# EAGLE design application (EAGLE 9.6.2)
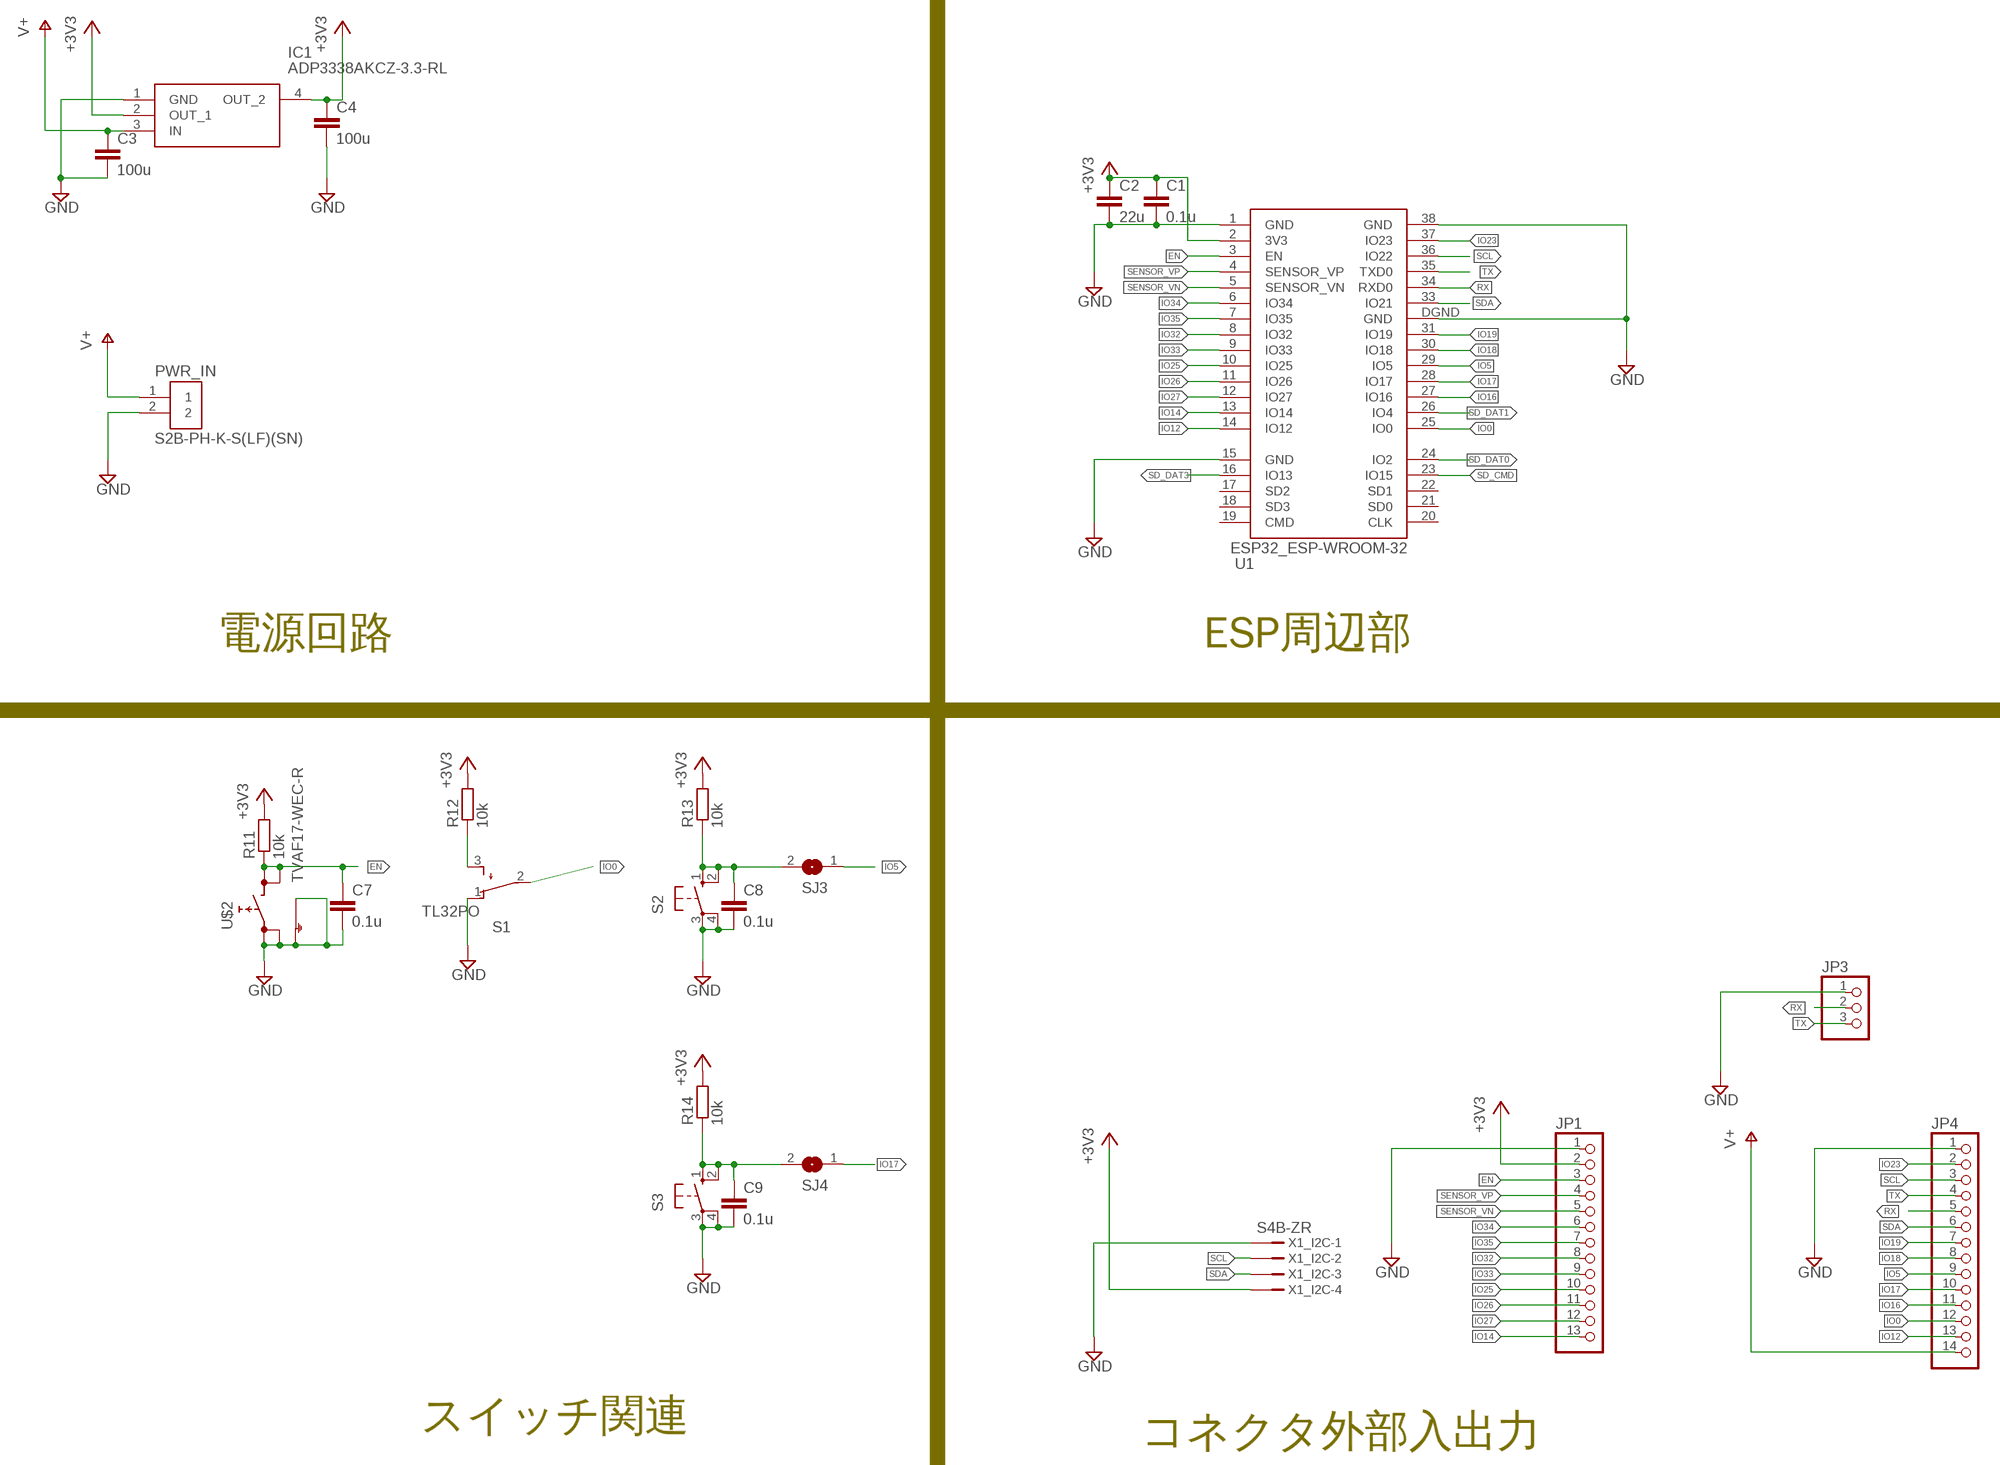
[diagram p0: schematic, sheet 1]

## Parts
C1  0.1u  C-EUC0603K  [C0603K]
C2  22u  C-EUC0805  [C0805]
C3  100u  C-EUC1206  [C1206]
C4  100u  C-EUC1206  [C1206]
C7  0.1u  C-EUC0603K  [C0603K]
C8  0.1u  C-EUC0603K  [C0603K]
C9  0.1u  C-EUC0603K  [C0603K]
IC1  ADP3338AKCZ-3.3-RL  [SOT230P700X180-4N]
JP1  PINHD-1X13  [1X13]
JP3  PINHD-1X3  [1X03]
JP4  PINHD-1X14  [1X14]
PWR_IN  S2B-PH-K-S(LF)(SN)  [S2B-PH-K-S(LF)(SN)]
R11  10k  R-EU_R0603  [R0603]
R12  10k  R-EU_R0603  [R0603]
R13  10k  R-EU_R0603  [R0603]
R14  10k  R-EU_R0603  [R0603]
S1  TL32PO  [TL3XPO]
S2  10-XX  [B3F-10XX]
S3  10-XX  [B3F-10XX]
SJ3  SJW  [SJW]
SJ4  SJW  [SJW]
U1  ESP32_ESP-WROOM-32  [ESP32_ESP-WROOM-32]
U$2  TVAF17-WEC-R  [TVAF17-WEC-R]
X1_I2C  S4B-ZR  [S4B-ZR]

## Nets
+3V3: C1.1 C2.1 C4.1 IC1.2(OUT_1) IC1.4(OUT_2) JP1.2 R11.2 R12.2 R13.2 R14.2 U1.2(3V3) X1_I2C.4
EN: C7.1 JP1.3 R11.1 U1.3(EN) U$2.P$3 U$2.P$4
GND: C1.2 C2.2 C3.2 C4.2 C7.2 C8.2 C9.2 IC1.1(GND) JP1.1 JP3.1 JP4.1 PWR_IN.2 S1.1(O) S2.3(P) S2.4(P1) S3.3(P) S3.4(P1) U1.1(GND) U1.15(GND) U1.38(GND) U1.DGND(GND) U$2.P$1 U$2.P$2 U$2.P$5 U$2.P$6 X1_I2C.1
IO0: JP4.12 S1.2(P) U1.25(IO0)
IO5: JP4.9 SJ3.1 U1.29(IO5)
IO12: JP4.13 U1.14(IO12)
IO14: JP1.13 U1.13(IO14)
IO16: JP4.11 U1.27(IO16)
IO17: JP4.10 SJ4.1 U1.28(IO17)
IO18: JP4.8 U1.30(IO18)
IO19: JP4.7 U1.31(IO19)
IO23: JP4.2 U1.37(IO23)
IO25: JP1.10 U1.10(IO25)
IO26: JP1.11 U1.11(IO26)
IO27: JP1.12 U1.12(IO27)
IO32: JP1.8 U1.8(IO32)
IO33: JP1.9 U1.9(IO33)
IO34: JP1.6 U1.6(IO34)
IO35: JP1.7 U1.7(IO35)
N$2: C8.1 R13.1 S2.1(S) S2.2(S1) SJ3.2
N$3: C9.1 R14.1 S3.1(S) S3.2(S1) SJ4.2
N$4: R12.1 S1.3(S)
RX: JP3.2 JP4.5 U1.34(RXD0)
SCL: JP4.3 U1.36(IO22) X1_I2C.2
SD_CMD: U1.23(IO15)
SD_DAT0: U1.24(IO2)
SD_DAT1: U1.26(IO4)
SD_DAT3: U1.16(IO13)
SDA: JP4.6 U1.33(IO21) X1_I2C.3
SENSOR_VN: JP1.5 U1.5(SENSOR_VN)
SENSOR_VP: JP1.4 U1.4(SENSOR_VP)
TX: JP3.3 JP4.4 U1.35(TXD0)
V+: C3.1 IC1.3(IN) JP4.14 PWR_IN.1
Unconnected: U1.17(SD2) U1.18(SD3) U1.19(CMD) U1.20(CLK) U1.21(SD0) U1.22(SD1)

## Notes on the sheet
- 電源回路 | ESP周辺部
- スイッチ関連
- コネクタ外部入出力

## Library data of the parts
C1 C7-C9 = rcl:C-EU: CAPACITOR, European symbol; SPICEPREFIX: C; TYPE: C1608JB1H104K
C2 = rcl:C-EU: CAPACITOR, European symbol; SPICEPREFIX: C; TYPE: GRM21BR61E226ME44
C3 C4 = rcl:C-EU: CAPACITOR, European symbol; SPICEPREFIX: C; TYPE: GRM31C61A107ME05
IC1 = SamacSys_Parts:ADP3338AKCZ-3.3-RL: LDO Voltage Regulator anyCAP 1A SOT223-3 Analog Devices ADP3338AKCZ-3.3-RL, LDO Voltage Regulator, 1.6A, 3.3 V +/-0.8%, 2.7 8 Vin, 3 + Tab-Pin SOT-223 Source: Datasheet <http://www.analog.com/media/en/technical-documentation/data-sheets/ADP3338.pdf>; DESCRIPTION: LDO Voltage Regulator anyCAP 1A SOT223-3 Analog Devices ADP3338AKCZ-3.3-RL, LDO Voltage Regulator, 1.6A, 3.3 V +/-0.8%, 2.7 8 Vin, 3 + Tab-Pin SOT-223; HEIGHT: 1.8mm; MANUFACTURER_NAME: Analog Devices; MANUFACTURER_PART_NUMBER: ADP3338AKCZ-3.3-RL; MOUSER_PART_NUMBER: 584-ADP3338AKCZ3.3R; MOUSER_PRICE-STOCK: https://www.mouser.co.uk/ProductDetail/Analog-Devices/ADP3338AKCZ-33-RL?qs=WIvQP4zGangPtIg4n%252B1tTA%3D%3D
JP1 = pinhead:PINHD-1X13: PIN HEADER
JP3 = pinhead:PINHD-1X3: PIN HEADER
JP4 = pinhead:PINHD-1X14: PIN HEADER
PWR_IN = Connectors:S2B-PH-K-S(LF)(SN): CONN HEADER R/A 2POS 2MM Manufacturer's datasheet <http://www.jst-mfg.com/product/pdf/eng/ePH.pdf>; CREATED_BY: PCBLayout.com; DIGI_KEY_PART_NUMBER: 455-1719-ND; MANUFACTURER: JST Sales America Inc.; MPN: S2B-PH-K-S(LF)(SN)
R11-R14 = rcl:R-EU_: RESISTOR, European symbol; SPICEPREFIX: R
S1 = switch:TL32PO: TINY SWITCH ON - MOM Source: http://www2.produktinfo.conrad.com/datenblaetter/700000-724999/705152-da-01-de-Subminiaturschalter_TL_36YO.pdf
S2 S3 = switch-omron:10-XX: OMRON SWITCH; MPN: B3F-1000; OC_FARNELL: 176432; OC_NEWARK: 36M3542
SJ3 SJ4 = jumper:SJ: SMD solder JUMPER
U1 = application:ESP32_ESP-WROOM-32: Espressif Systems ESP-WROOM-32
U$2 = untitled:TVAF17-WEC-R
X1_I2C = con-jst:?4B-ZR: ZH CONNECTOR 1.5 mm, 4 pin 1 row Source: http://www.jst.com .. eZH.pdf; MF: FARNELL; MPN: S4B-ZR(LF)(SN); OC_FARNELL: 9491830; OC_NEWARK: 38K8076

## Board
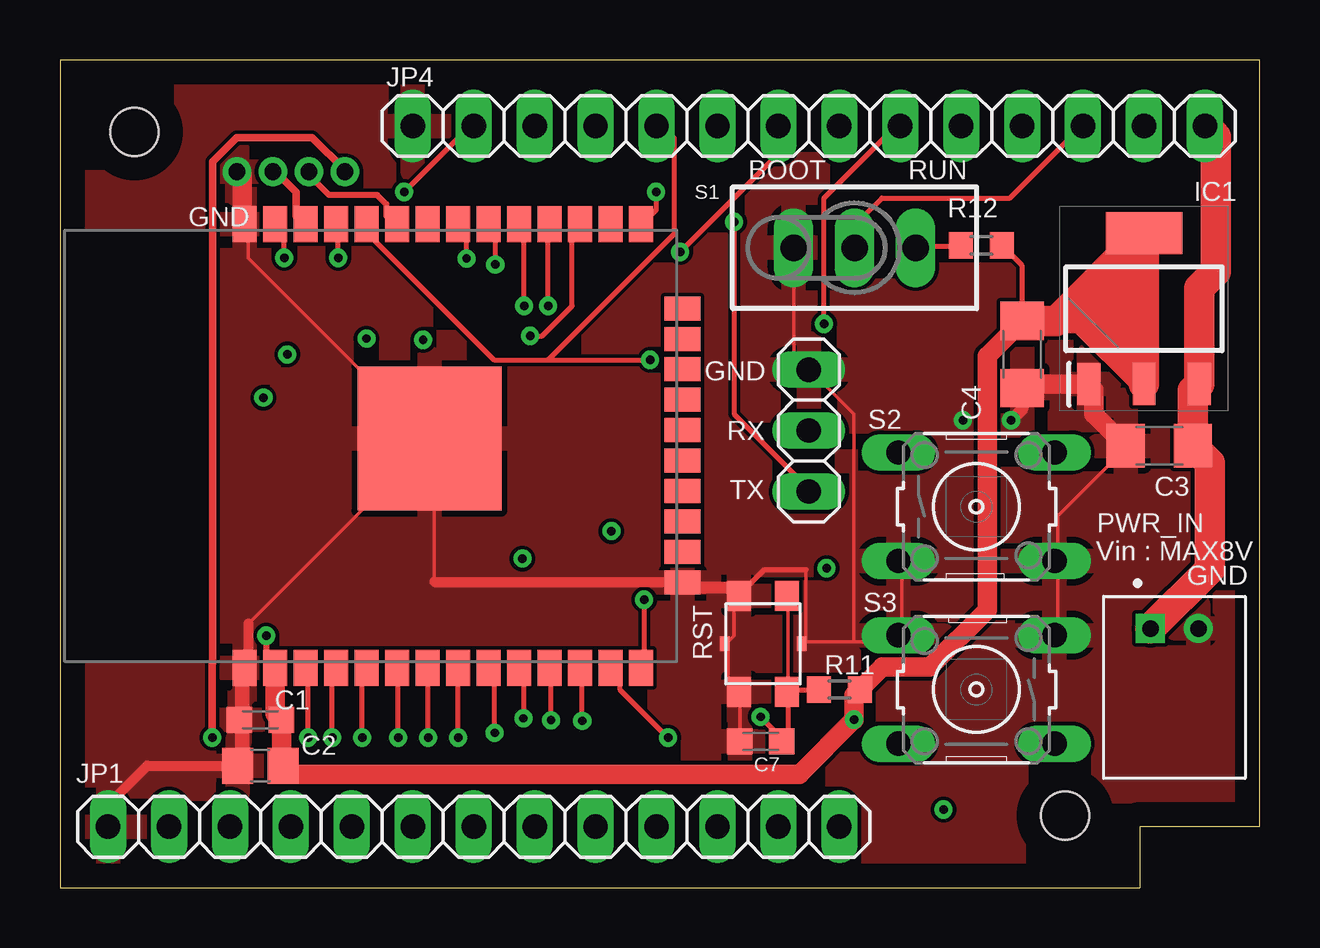
[diagram p1: board, top side]
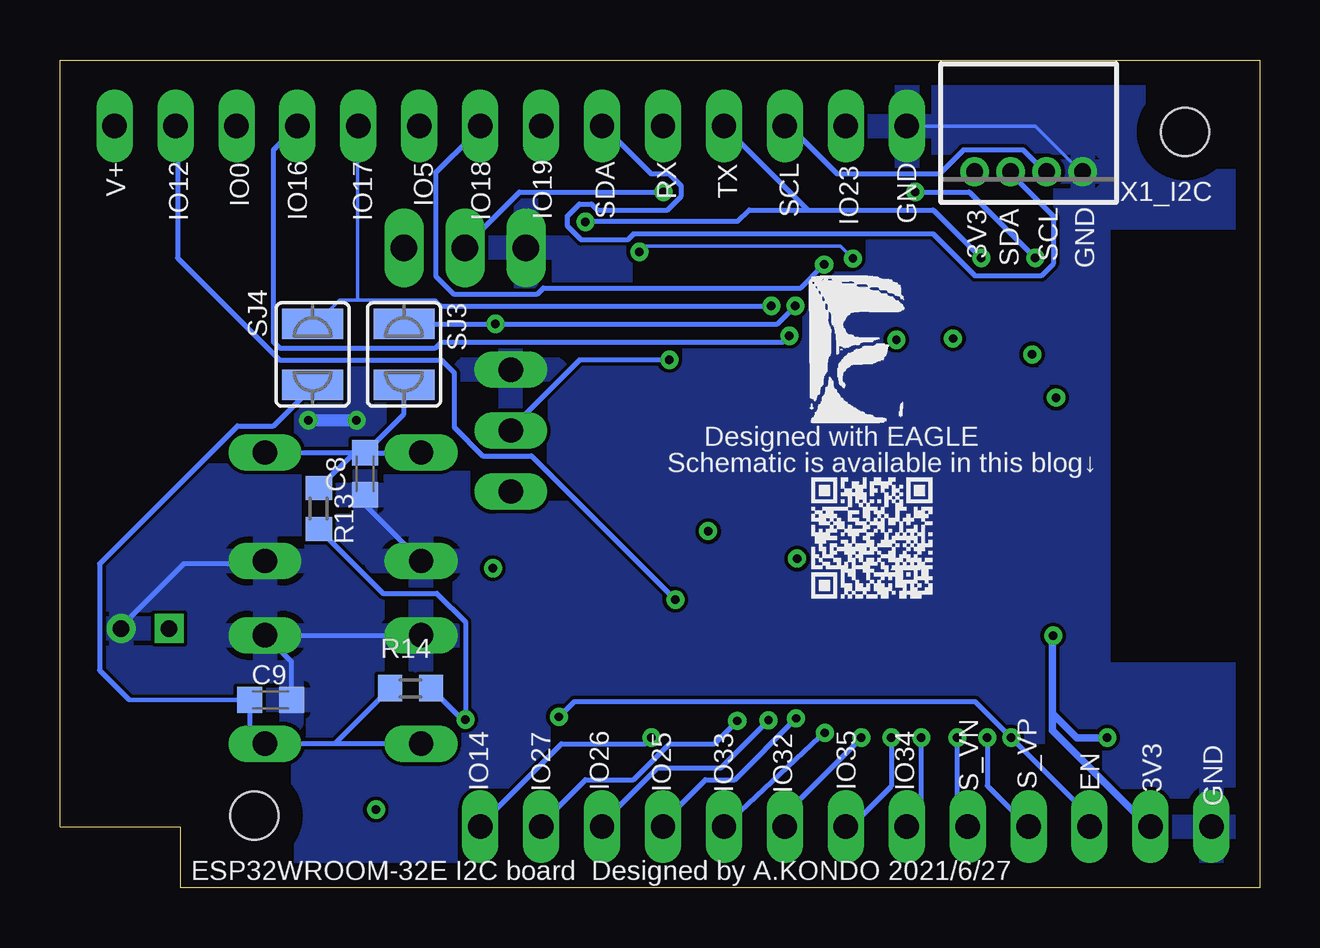
[diagram p2: board, bottom side, seen from below]

Size 50 x 34.5 mm. Coordinates in mm from the lower left corner, seen from the top.
Outline: 0,0 45,0 45,2.54 50,2.54 50,34.5 0,34.5 0,0
Copper layers (1*16): Top 0.035mm / dielectric 1.5mm / Bottom 0.035mm
Design rules "default": minimum track width 6mil, minimum drill 0.35mm, track to track 6mil, track to pad 6mil, pad to pad 6mil, via to via 6mil, smd to smd 6mil, copper to edge 40mil, drill to drill 6mil, minimum pad ring 10mil, minimum via ring 8mil, stop-mask expansion 4mil, vias tented up to drill 0mil, thermal gap 10mil
Holes 2 mm at 41.9,3 3.1,31.5

### Footprints (pad centres in the part's own frame; a part is rotated, then mirrored left to right if it is on the bottom)
C0603K = smd 1.05 x 1.08: 1 -0.875,0; 2 0.875,0
C0805 = smd 1.3 x 1.5: 1 -0.95,0; 2 0.95,0
C1206 = smd 1.6 x 1.8: 1 -1.4,0; 2 1.4,0
SOT230P700X180-4N = smd 1.75 x 0.95: 1 -3.15,2.3; 2 -3.15,0; 3 -3.15,-2.3 | smd 1.75 x 3.2: 4 3.15,0
1X13 = drill 1.016 long: 1 -15.24,0; 2 -12.7,0; 3 -10.16,0; 4 -7.62,0; 5 -5.08,0; 6 -2.54,0; 7 0,0; 8 2.54,0; 9 5.08,0; 10 7.62,0; 11 10.16,0; 12 12.7,0; 13 15.24,0
1X03 = drill 1.016 long: 1 -2.54,0; 2 0,0; 3 2.54,0
1X14 = drill 1.016 long: 1 -16.51,0; 2 -13.97,0; 3 -11.43,0; 4 -8.89,0; 5 -6.35,0; 6 -3.81,0; 7 -1.27,0; 8 1.27,0; 9 3.81,0; 10 6.35,0; 11 8.89,0; 12 11.43,0; 13 13.97,0; 14 16.51,0
S2B-PH-K-S(LF)(SN) = drill 0.7 square: 1 -1,0 | drill 0.7: 2 1,0
R0603 = smd 1 x 1.1: 1 -0.85,0; 2 0.85,0
TL3XPO = drill 1.1 pad 1.422 long: 1 -2.54,0; 2 0,0; 3 2.54,0
B3F-10XX = drill 1.016 long: 1 -3.251,2.261; 2 3.251,2.261; 3 -3.251,-2.261; 4 3.251,-2.261
SJW = smd 1.27 x 2.54: 1 -1.27,0; 2 1.27,0
ESP32_ESP-WROOM-32 = smd 1.5 x 1: 1 -9.25,7; 2 -9.25,5.73; 3 -9.25,4.46; 4 -9.25,3.19; 5 -9.25,1.92; 6 -9.25,0.65; 7 -9.25,-0.62; 8 -9.25,-1.89; 9 -9.25,-3.16; 10 -9.25,-4.43; 11 -9.25,-5.7; 12 -9.25,-6.97; 13 -9.25,-8.24; 14 -9.25,-9.51; 25 9.25,-9.51; 26 9.25,-8.24; 27 9.25,-6.97; 28 9.25,-5.7; 29 9.25,-4.43; 30 9.25,-3.16; 31 9.25,-1.89; 32 9.25,-0.62; 33 9.25,0.65; 34 9.25,1.92; 35 9.25,3.19; 36 9.25,4.46; 37 9.25,5.73; 38 9.25,7 | smd 1 x 1.5: 15 -5.7,-11.25; 16 -4.43,-11.25; 17 -3.16,-11.25; 18 -1.89,-11.25; 19 -0.62,-11.25; 20 0.65,-11.25; 21 1.92,-11.25; 22 3.19,-11.25; 23 4.46,-11.25; 24 5.73,-11.25 | smd 6 x 6: DGND 0.3,-0.7
TVAF17-WEC-R = smd 1.25 x 1: P$1 -2,1; P$2 2,1; P$3 -2,-1; P$4 2,-1 | smd 0.6 x 0.4: P$5 0,1.6; P$6 0,-1.6
S4B-ZR = drill 0.7 pad 1.1: 1 -2.25,0; 2 -0.75,0; 3 0.75,0; 4 2.25,0

### Placement (x,y rotation side)
C1  8.36,6.99 180 top
C2  8.36,5.08 180 top
C3  45.82,18.41 180 top
C4  40.11,22.23 270 top
C7  29.21,6.1 180 top
C8  37.29,17.25 270 bottom
C9  41.22,7.82 0 bottom
IC1  45.19,24.13 90 top
JP1  17.25,2.54 0 top
JP3  31.21,19.05 270 top
JP4  31.21,31.75 0 top
PWR_IN  46.45,10.79 0 top
R11  32.48,8.26 0 top
R12  38.4,26.77 0 top
R13  39.22,15.8 270 bottom
R14  35.38,8.31 0 bottom
S1  33.12,26.67 0 top
S2  38.2,15.88 0 top
S3  38.2,8.26 180 top
SJ3  35.66,22.23 270 bottom
SJ4  39.47,22.23 270 bottom
U1  14.71,18.41 90 top
U$2  29.31,10.16 90 top
X1_I2C  9.62,29.84 180 bottom

### Tracks (layer width: path | path; a pad name or v marks a point on that pad's centre or on a via)
+3V3  (via drill 0.35)
  Top 0.152: v33.1,7 | 8.6,9.5 8.85,9.25 U1.2
  Top 0.2: C4.1 40.11,25.92 R12.2
  Top 0.254: v8.6,10.5 8.6,9.5
  Top 0.305: v6.35,6.25 6.35,9.34 6.36,9.35 6.36,30.26 7.36,31.27 10.51,31.27 11.88,29.91 X1_I2C.4
  Top 0.813: U1.2 8.97,7.24 C1.1 9.23,5.16 C2.1 9.67,4.72 30.81,4.72 v33.1,7 | v33.1,7 33.1,8.02 R11.2 34.27,9.2 36.26,9.2 38.65,11.58 38.65,22.17 C4.1 | 43.42,24.52 42.98,24.08 42.98,23.62
  Top 1.016: IC1.2 42.54,23.62 | C4.1 42.54,23.62 | 42.54,23.62 42.98,23.62 43.61,23.62 44.6,22.63 45.17,23.2 43.85,24.52 | 43.85,24.52 43.42,24.52 | 45.19,25.88 43.85,24.55 43.85,24.52
  Top 1.27: C4.1 41.53,23.62 IC1.4 45.19,25.88 IC1.2
  Bottom 0.152: 8.62,10.47 v8.6,10.5
  Bottom 0.2: 6.35,4.27 | 4.62,2.54 JP1.2 | R13.2 36.54,12.27 34.29,12.27 33.1,11.07 v33.1,7 33.23,7 R14.2
  Bottom 0.305: 8.62,10.47 8.62,7.26 | 8.62,7.26 8.62,6.54 6.35,4.27 | 6.35,4.27 4.62,2.54 | v6.35,6.25 7.61,6.25 8.62,7.26
EN  (via drill 0.35)
  Top 0.152: 30.35,6.34 30.14,6.15 C7.1 | 30.35,8 U$2.P$3 30.35,8.25 30.35,12 U$2.P$4 | 31.6,8.25 R11.1 | 10.35,9 U1.3
  Top 0.2: 30.35,8 30.35,6.34 | 30.35,8.25 31.6,8.25 | v10.35,6.25 10.35,9 | v29.2,7.12 30.14,6.18 30.14,6.15
  Bottom 0.152: 6.85,2.75 JP1.3
  Bottom 0.2: 6.85,2.75 v10.35,6.25 11.85,7.75 28.57,7.75 v29.2,7.12
GND  (via drill 0.35)
  Top 0.152: 42.85,21 IC1.1 43.1,20.75 | 40.35,21 C4.2 | 44.35,18.5 C3.2 44.35,18.25 41.6,15.5 41.6,13.75 S2.4 41.6,13.5 41.6,10.75 S3.3 | S1.1 30.6,26.5 30.6,22.25 31.1,21.75 JP3.1 31.35,21.5 33.1,19.75 33.1,10.25 | C7.2 28.35,6.12 28.35,8 U$2.P$1 28.1,8.25 27.85,8.5 27.85,10 U$2.P$5 27.85,10.25 28.1,10.5 28.1,12 U$2.P$2 | 28.1,12.5 28.1,12.25 U$2.P$2 | 26.1,12.5 U1.15 25.85,12.75 | 33.1,10.25 34.85,10.25 34.85,10.5 S3.4 35.1,10.75 35.1,13.5 S2.3 | 33.1,10.25 31.1,10.25 | 31.1,10.25 31.1,13.25 | 28.35,12.25 U$2.P$2 | 31.1,10.25 U$2.P$6 | 7.6,6.75 C1.2 7.6,7 | 7.6,5.25 C2.2 7.35,5 | 7.6,9 U1.1 7.85,9.25 | 7.6,27.75 U1.38 7.85,27.5 7.85,26.25 15.35,18.75 U1.DGND | 7.85,11 15.4,18.55 U1.DGND | 15.6,12.75 15.6,18.5 U1.DGND
  Top 0.2: 28.35,12.25 29.35,13.25 31.1,13.25
  Top 0.406: 7.85,11 7.85,9.25 | 15.6,12.75 25.85,12.75 | JP1.1 2,3.45 3.63,5.08 7.27,5.08 7.35,5
  Top 0.508: 28.1,12.5 26.1,12.5 | C4.2 40.11,19.94 v39.65,19.48
  Top 0.61: 7.6,5.25 7.6,6.75 | 7.6,7 7.6,9
  Top 0.813: 40.35,21 42.85,21 | 44.35,18.5 43.1,19.75 43.1,20.75 | 7.6,27.75 7.6,29.75 X1_I2C.1
  Bottom 0.152: JP4.1 9.35,31.75 7.6,30 X1_I2C.1
  Bottom 0.2: PWR_IN.2 47.35,11 44.85,13.5 41.6,13.5 S2.4 | C8.2 37.29,15.95 S2.3 | S3.4 S3.3 40.35,9.41 C9.2
  Bottom 0.508: v39.65,19.48 v37.64,19.48
  pour Top: -3.07,37.47 -3.07,-3.17 -1.8,-4.45 65.45,-4.45 65.45,40.64 0.1,40.64
  pour Bottom: -4.98,-3.81 2,-10.79 73.76,-10.79 76.3,-8.26 76.3,27.94 62.97,41.27 -4.98,41.27 -4.98,38.73 -4.98,37.47
IO0  (via drill 0.35)
  Top 0.152: 24.35,27.75 U1.25 | 42.6,31.75 JP4.12
  Top 0.2: 24.35,27.75 24.85,28.25 v24.85,29 | 42.6,31.75 39.6,28.75 34.26,28.75 33.6,28.09 33.6,27.15 S1.2
  Bottom 0.152: 33.1,26.75 S1.2
  Bottom 0.2: v24.85,29 30.85,29 33.1,26.75
IO5  (via drill 0.35)
  Top 0.152: 19.35,27.5 U1.29 | 34.85,31.75 JP4.9
  Top 0.2: v19.35,24.25 19.35,27.5 | 34.85,31.75 31.85,28.75 v31.85,23.5
  Bottom 0.152: 35.6,23.5 SJ3.1
  Bottom 0.2: v19.35,24.25 20.1,23.5 v31.85,23.5 35.6,23.5
IO12  (via drill 0.35)
  Top 0.152: 24.35,9.25 U1.14
  Top 0.2: v24.35,12 24.35,9.25
  Bottom 0.152: 45.1,31.75 JP4.13
  Bottom 0.2: v24.35,12 30.35,18 32.38,18 33.57,19.19 33.57,21.47 34.1,22 40.85,22 45.1,26.25 45.1,31.75
IO14  (via drill 0.35)
  Top 0.152: 23.35,8.75 23.1,9 U1.13
  Top 0.2: 23.35,8.75 23.35,8.25 v25.35,6.25
  Bottom 0.152: 25.6,6 v25.35,6.25 | 32.35,2.75 JP1.13
  Bottom 0.2: 25.6,6 29.1,6 32.35,2.75
IO16  (via drill 0.35)
  Top 0.152: 21.35,27.25 21.6,27.5 U1.27
  Top 0.2: 21.35,27.25 21.35,24.25 20.1,23 v19.6,23
  Bottom 0.152: 19.85,22.75 v19.6,23
  Bottom 0.2: 19.85,22.75 34.1,22.75 34.35,22.5 40.85,22.5 41.1,22.75 41.1,30.75 JP4.11
IO17  (via drill 0.35)
  Top 0.152: 20.35,27.5 U1.28
  Top 0.2: v20.35,24.25 20.35,27.5
  Bottom 0.152: 34.1,24.25 34.35,24.5 37.6,24.5 | 37.6,24.5 38.35,24.5 39.35,23.5 SJ4.1 | 37.6,24.5 37.6,31.75 JP4.10
  Bottom 0.2: 34.1,24.25 v20.35,24.25
IO18  (via drill 0.35)
  Top 0.152: 18.1,27.5 U1.30
  Top 0.2: 18.1,27.5 18.15,27.45 v18.15,25.98
  Bottom 0.2: v18.15,25.98 19.12,25 29.85,25 30.1,24.75 33.6,24.75 34.33,25.48 34.33,29.82 32.81,31.33 32.48,31.33 JP4.8
IO19  (via drill 0.35)
  Top 0.152: 16.6,27.5 U1.31
  Top 0.2: 16.6,27.5 16.95,27.15 v16.95,26.23 | v25.85,26.5 29.85,30.5 29.85,31.75 JP4.7
  Bottom 0.152: v16.95,26.23 17.47,26.75 25.6,26.75 v25.85,26.5
IO23  (via drill 0.35)
  Top 0.152: 9.35,27.25 9.1,27.5 U1.37
  Top 0.2: v9.35,26.25 9.35,27.25 | v14.35,29 17.1,31.75 JP4.2
  Bottom 0.2: v9.35,26.25 12.1,29 v14.35,29
IO25  (via drill 0.35)
  Top 0.152: 19.32,9.02 U1.10
  Top 0.2: 19.32,9.02 v19.32,7.05
  Bottom 0.2: v19.32,7.05 21.87,4.5 23.1,4.5 24.85,2.75 JP1.10
IO26  (via drill 0.35)
  Top 0.152: 20.47,9.11 U1.11
  Top 0.2: v20.47,6.97 20.47,9.11
  Bottom 0.2: v20.47,6.97 22.44,5 25.1,5 27.35,2.75 JP1.11
IO27  (via drill 0.35)
  Top 0.152: 21.77,9.08 U1.12
  Top 0.2: v21.77,6.95 21.77,9.08
  Bottom 0.152: 29.85,2.75 JP1.12
  Bottom 0.2: v21.77,6.95 22.72,6 24.6,6 26.1,4.5 28.1,4.5 29.85,2.75
IO32  (via drill 0.35)
  Top 0.152: 16.6,9 U1.8
  Top 0.2: v16.6,6.25 16.6,9
  Bottom 0.2: v16.6,6.25 19.6,3.25 19.6,2.75 JP1.8
IO33  (via drill 0.35)
  Top 0.152: 18.12,8.98 18.1,9 U1.9
  Top 0.2: v18.12,6.45 18.12,8.98
  Bottom 0.2: v18.12,6.45 18.35,6.25 JP1.9
IO34  (via drill 0.35)
  Top 0.152: 14.1,9 U1.6
  Top 0.2: v14.1,6.25 14.1,9
  Bottom 0.152: 14.1,2.75 14.6,2.75 JP1.6
  Bottom 0.2: 14.1,2.75 v14.1,6.25
IO35  (via drill 0.35)
  Top 0.152: 15.35,9 U1.7
  Top 0.2: v15.35,6.25 15.35,9
  Bottom 0.2: JP1.7 17.03,2.54 15.35,4.22 v15.35,6.25
N$1  (via drill 0.35)
  other vias: 8.48,20.42
N$2
  Bottom 0.2: C8.1 35.66,19.75 SJ3.2 | C8.1 41.44,18.12 S2.2 | C8.1 34.96,18.12 S2.1 | R13.1 37.74,18.12 C8.1
N$3
  Bottom 0.152: 39.6,20.75 SJ4.2
  Bottom 0.2: 39.6,20.75 41.1,19.25 42.6,19.25 48.35,13.5 48.35,9.06 47.13,7.84 C9.1 42.1,6.64 S3.1 38.54,5.99 | R14.1 38.54,5.99 | S3.2 38.54,5.99
N$4
  Top 0.152: 37.51,26.75 R12.1 | 35.85,26.75 S1.3
  Top 0.2: 35.85,26.75 37.51,26.75
N$5  (via drill 0.35)
  other vias: 15.14,22.83
N$6  (via drill 0.35)
  other vias: 12.77,22.89
N$7  (via drill 0.35)
  other vias: 9.47,22.23
N$8  (via drill 0.35)
  other vias: 31.95,13.31
N$9  (via drill 0.35)
  other vias: 22.99,14.86
N$10  (via drill 0.35)
  other vias: 19.28,13.72
N$11  (via drill 0.35)
  other vias: 36.83,3.25
RX  (via drill 0.35)
  Top 0.152: 13.1,27 13.1,27.25 12.85,27.5 U1.34
  Top 0.2: JP4.5 25.1,31.75 25.6,31.25 25.6,27.25 24.85,26.5 20.35,22 | 20.35,22 v24.6,22 | 13.1,27 18.1,22 20.32,22 20.35,22
  Bottom 0.2: v24.6,22 28.35,22 31.1,19.25 JP3.2
SCL
  Top 0.152: 9.85,28 10.1,27.75 U1.36
  Top 0.305: 9.85,28 9.85,29 9.1,29.75 X1_I2C.2
  Bottom 0.2: JP4.3 19.6,31.75 17.6,29.75 13.35,29.75 12.35,30.75 9.85,30.75 9.1,30 X1_I2C.2
SDA
  Top 0.152: 13.6,28 13.85,27.75 U1.33
  Top 0.254: 13.6,28 13.6,28.5 13.23,28.87 11.21,28.87 10.52,29.56 10.52,29.78
  Top 0.305: 10.52,29.78 X1_I2C.3
  Bottom 0.152: 27.35,31.75 JP4.6 | 10.35,29.75 X1_I2C.3
  Bottom 0.2: 27.35,31.75 25.35,29.75 24.6,29.75 24.1,29.25 24.1,28.83 24.68,28.25 27.6,28.25 27.85,28.5 28.35,28.5 28.85,28 28.85,27.58 28.27,27 26.35,27 26.1,27.25 13.6,27.25 11.85,25.5 9.1,25.5 8.6,26 8.6,28 10.35,29.75
SENSOR_VN  (via drill 0.35)
  Top 0.152: 12.6,9 U1.5
  Top 0.2: v12.6,6.25 12.6,9
  Bottom 0.2: v12.6,6.25 12.6,2.75 12.35,2.75 JP1.5
SENSOR_VP  (via drill 0.35)
  Top 0.152: 11.35,9 U1.4
  Top 0.2: v11.35,6.25 11.35,9
  Bottom 0.2: JP1.4 9.85,2.75 11.1,4 11.35,4.25 v11.35,6.25
TX  (via drill 0.35)
  Top 0.152: 11.6,27.5 U1.35 | 31.1,16.75 JP3.3
  Top 0.2: v11.6,26.25 11.6,27.5 | 31.1,16.75 28.1,19.75 v28.1,27.75
  Bottom 0.152: v28.1,27.75 28.08,27.77
  Bottom 0.2: v11.6,26.25 13.6,28.25 18.83,28.25 | JP4.4 18.83,28.25 | 18.83,28.25 21.28,28.25 21.75,27.77 28.08,27.77
V+
  Top 1.27: PWR_IN.1 47.93,13.27 47.93,17.71 C3.1 47.22,20.71 IC1.3 47.48,24.98 48.17,25.67 48.17,31.3 JP4.14

### Text on the board
tPlace: BOOT | RUN | GND | GND | RX | TX | GND
bPlace: GND | IO23 | SCL | TX | RX | SDA | IO19 | IO18 | IO5 | IO17 | IO16 | IO0 | IO12 | V+ | GND | SCL | SDA | 3V3 | Designed with EAGLE | S_VP | S_VN | IO34 | IO35 | IO26 | IO27 | IO14 | GND | 3V3 | EN | IO32 | IO33 | IO25 | ESP32WROOM-32E I2C board Designed by A.KONDO 2021/6/27
tNames: Vin : MAX8V | RST
bNames: Schematic is available in this blog↓